# EasyEDA schematic PCB-Diagram_EasyEDA.json
TITLE: Schematic: PCB w/ LCD, Speaker, Controls; REV: 1.0; Date: 2020-06-05; Sheet: 1/1; Company: Deakin University
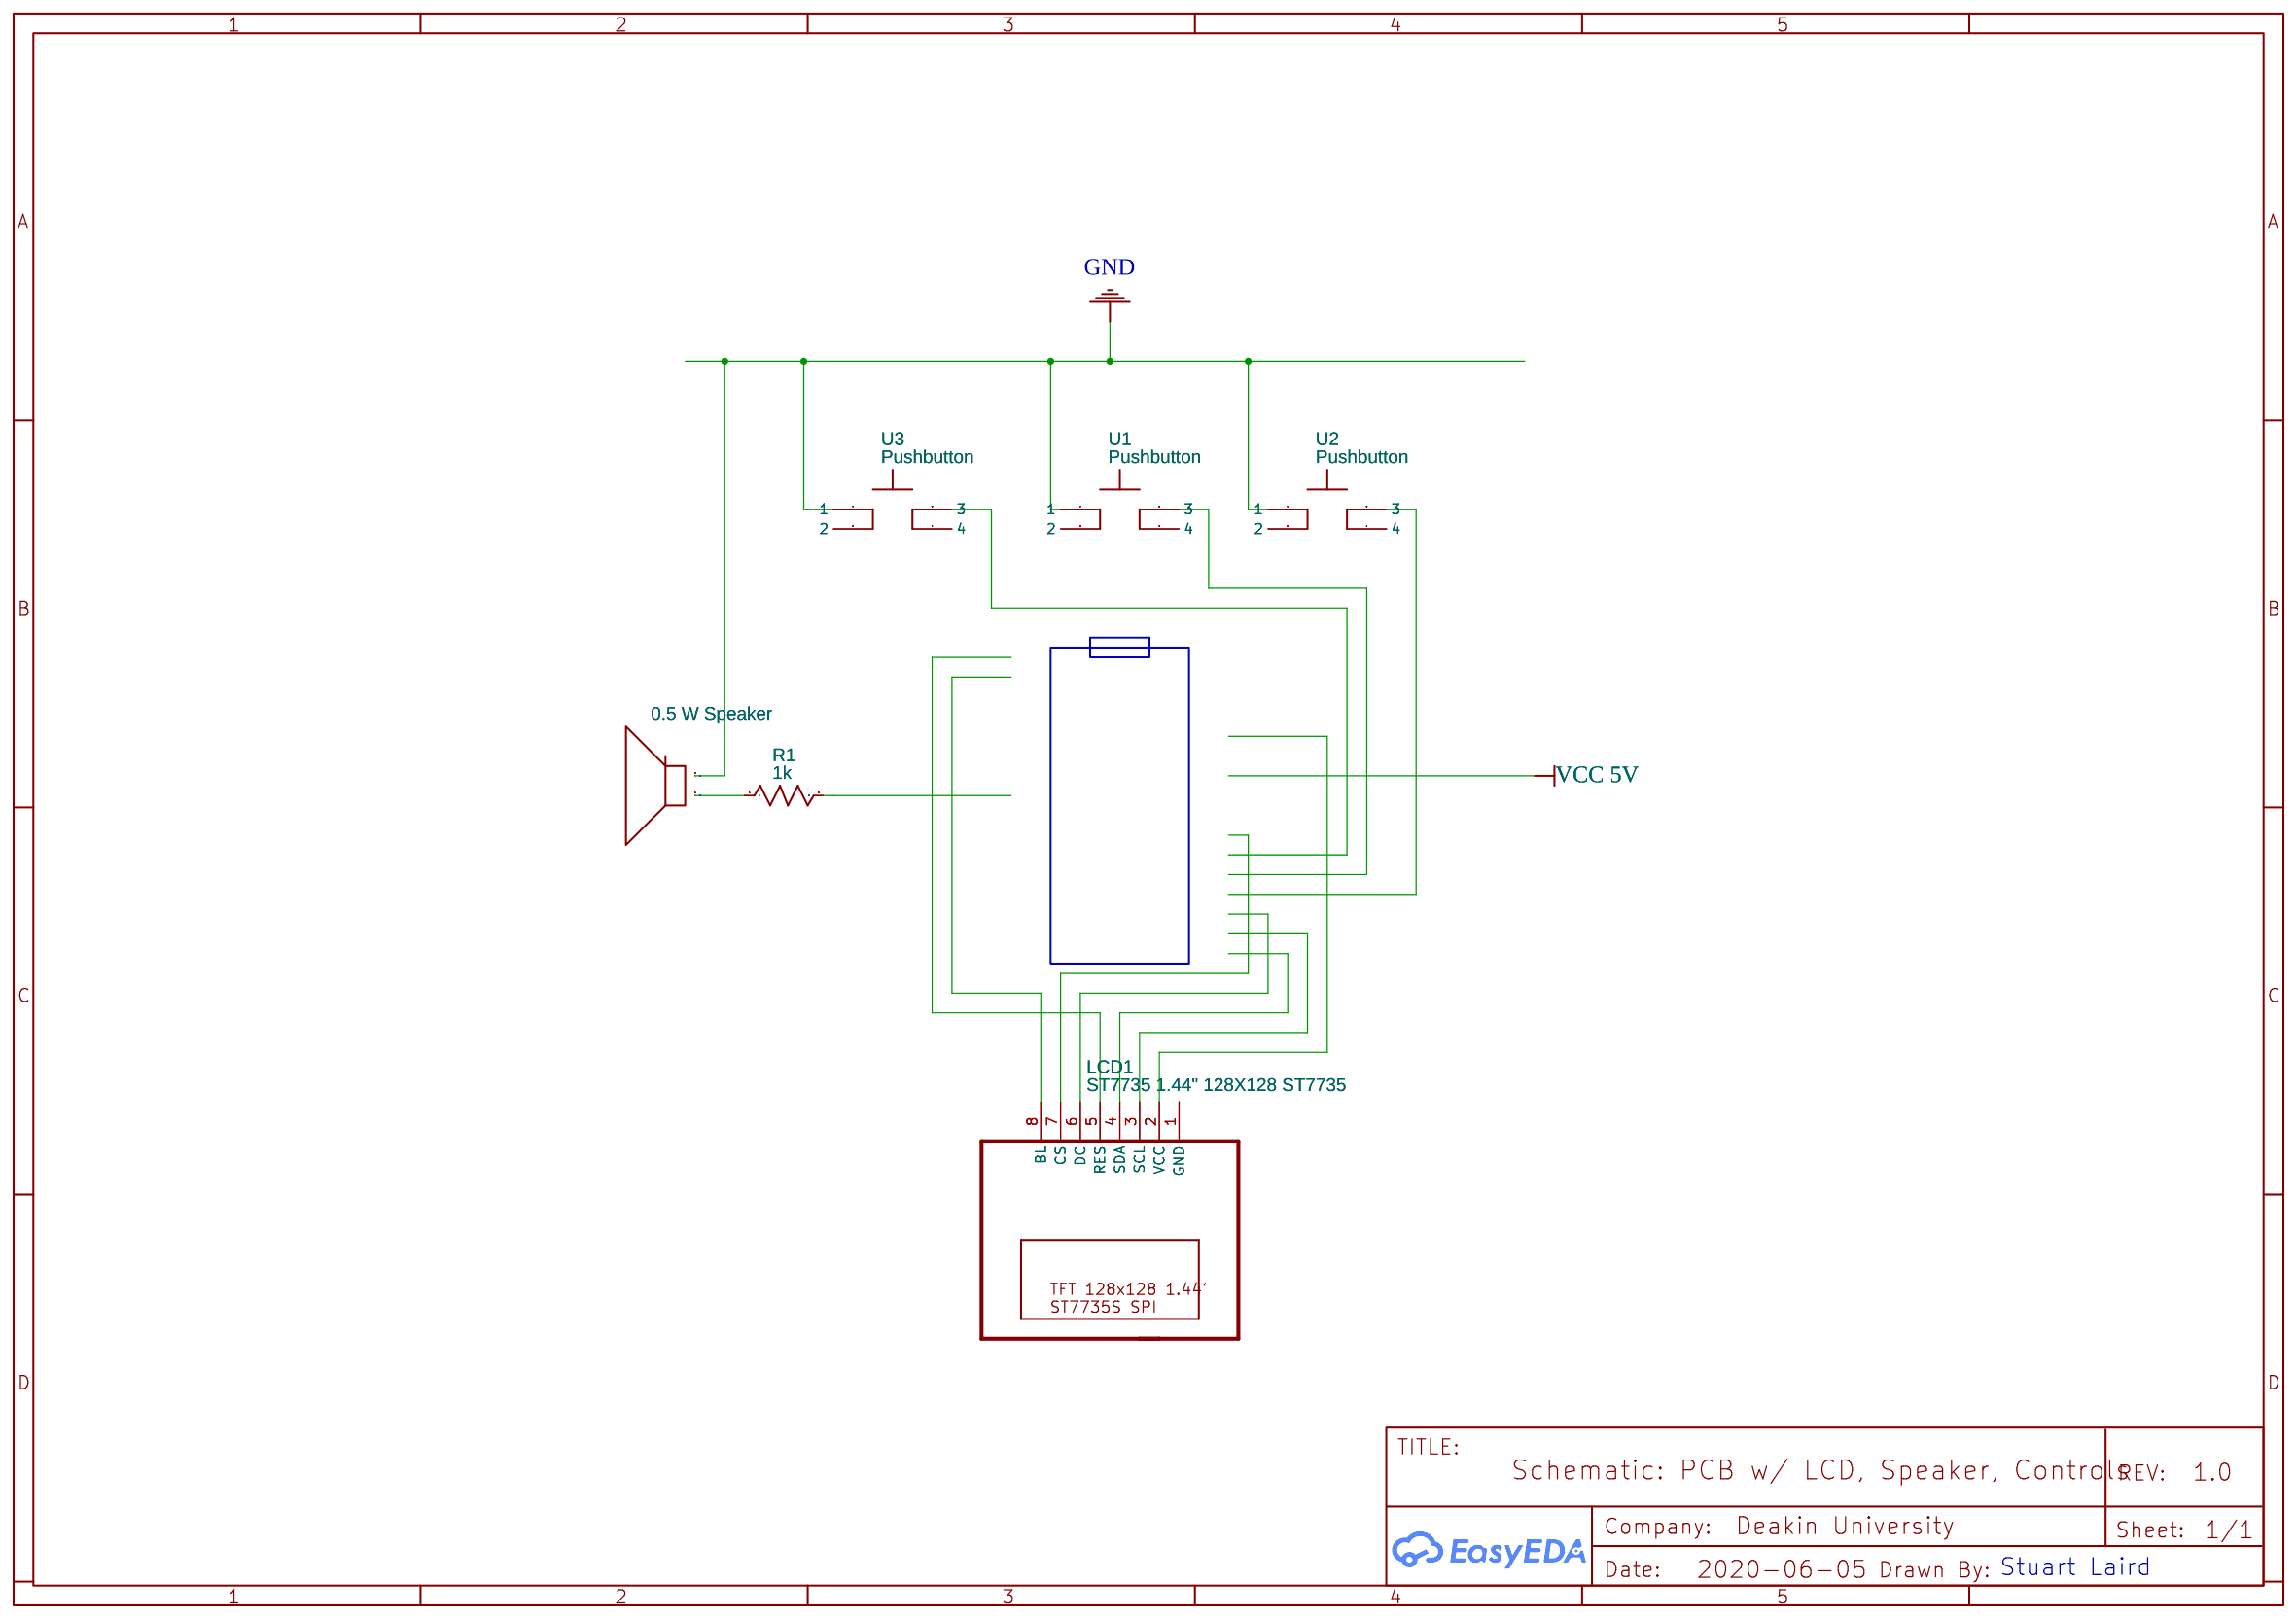
[diagram p0: schematic sheet]

## Parts
0.5WSPEAKER  0.5 W Speaker  [AXIAL-0.3]
LCD1  ST7735 1.44" 128X128 ST7735  [TFT1,8_SPI_128X160_ST7735S]
R1  1k  [R0201]
U1  Pushbutton  [PUSH BUTTON 6MM TA]
U2  Pushbutton  [PUSH BUTTON 6MM TA]
U3  Pushbutton  [PUSH BUTTON 6MM TA]

## Library data of the parts
0.5WSPEAKER = Speaker: Contributor: newDesigner
LCD1 = ST7735 1.44" 128X128 ST7735: Contributor: roman.sokolov
R1 = R_0201_US: Contributor: LCEDA_Lib
U1-U3 = Pushbutton: Contributor: SamDo96

## Nets
GND: 0.5WSPEAKER.2
Net-(0.5WSPEAKER-1): 0.5WSPEAKER.1 R1.1

Not connected (* = marked no-connect by the designer): LCD1 1(GND) 2(VCC) 3(SCL) 4(SDA) 5(RES) 6(DC) 7(CS) 8(BL); R1 2; U1 1 2 3 4; U2 1 2 3 4; U3 1 2 3 4

## Notes on the sheet
- Stuart Laird
